# EAGLE design targus-90w-switch-supply-monitor (EAGLE 5.07)
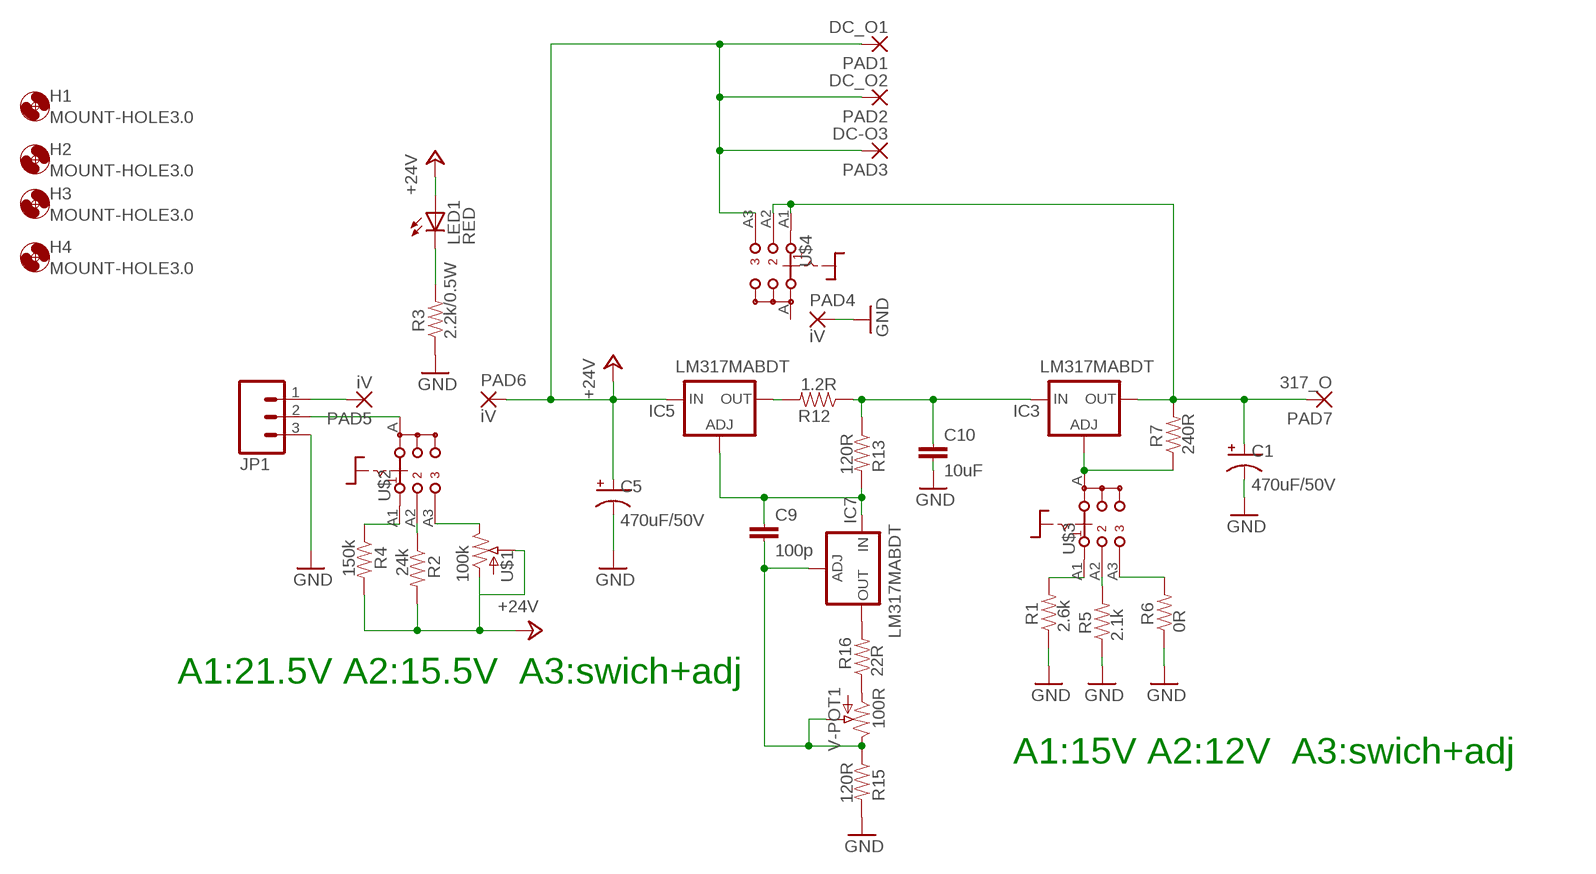
[diagram p0: schematic, sheet 1]

## Parts
C1  470uF/50V  CAP_POL-RF  [CPOL-SMD-10UF-25V]
C5  470uF/50V  CAP_POL-RF  [CPOL-SMD-10UF-25V]
C9  100p  CAP-RF  [CAP-SMD-SMALL]
C10  10uF  CAP-RF  [CAP-SMD-SMALL]
H1  MOUNT-HOLE3.0  [3,0]
H2  MOUNT-HOLE3.0  [3,0]
H3  MOUNT-HOLE3.0  [3,0]
H4  MOUNT-HOLE3.0  [3,0]
IC3  LM317MABDT  [DPACK]
IC5  LM317MABDT  [DPACK]
IC7  LM317MABDT  [DPACK]
JP1  M03VH  [VH-396-3]
LED1  RED  LEDSIDELED  [OSRAM-SIDELED]
PAD1  DC_O1  WIREPADSMD5-2,5  [5-2,5]
PAD2  DC_O2  WIREPADSMD5-2,5  [5-2,5]
PAD3  DC-O3  WIREPADSMD5-2,5  [5-2,5]
PAD4  iV  WIREPADSMD5-2,5  [5-2,5]
PAD5  iV  WIREPADSMD5-2,5  [5-2,5]
PAD6  iV  WIREPADSMD5-2,5  [5-2,5]
PAD7  317_O  WIREPADSMD5-2,5  [5-2,5]
R1  2.6k  RESISTOR1/4W-RF  [AXIAL-0.3-SMD]
R2  24k  RESISTOR1/4W-RF  [AXIAL-0.3-SMD]
R3  2.2k/0.5W  RESISTOR1/4W-RF  [AXIAL-0.3-SMD]
R4  150k  RESISTOR1/4W-RF  [AXIAL-0.3-SMD]
R5  2.1k  RESISTOR1/4W-RF  [AXIAL-0.3-SMD]
R6  0R  RESISTOR1/4W-RF  [AXIAL-0.3-SMD]
R7  240R  RESISTOR1/4W-RF  [AXIAL-0.3-SMD]
R12  1.2R  RESISTOR0617/22(3W)  [0617/22]
R13  120R  RESISTOR1/4W-RF  [AXIAL-0.3-SMD]
R15  120R  RESISTOR1/4W-RF  [AXIAL-0.3-SMD]
R16  22R  RESISTOR1/4W-RF  [AXIAL-0.3-SMD]
U$1  100k  POTPANNEL  [POT-PANNEL]
U$2  ROTATE-SWICH-1X3R  ROTATE-SWICH-1X3P  [ROT-SWITCH-1X3-PANNEL]
U$3  ROTATE-SWICH-1X3R  ROTATE-SWICH-1X3P  [ROT-SWITCH-1X3-PANNEL]
U$4  iV  ROTATE-SWICH-1X3P  [ROT-SWITCH-1X3-PANNEL]
V-POT1  100R  POTPANNEL  [POT-PANNEL]

## Nets
+24V: C5.+ IC5.3(IN) LED1.A PAD1.1(P) PAD2.1(P) PAD3.1(P) PAD6.1(P) R2.P$2 R4.P$2 U$1.A U$1.S U$4.A3
GND: C1.- C5.- C10.P$2 JP1.3 PAD4.1(P) R1.P$1 R3.P$1 R5.P$1 R6.P$1 R15.P$2
N$1: IC3.1(ADJ) R7.P$1 U$3.A
N$2: U$1.E U$2.A3
N$3: R2.P$1 U$2.A2
N$4: R4.P$1 U$2.A1
N$5: JP1.2 U$2.A
N$6: R1.P$2 U$3.A1
N$7: JP1.1 PAD5.1(P)
N$8: LED1.C R3.P$2
N$10: R5.P$2 U$3.A2
N$11: R6.P$2 U$3.A3
N$23: C1.+ IC3.4(OUT) PAD7.1(P) R7.P$2 U$4.A1 U$4.A2
N$24: C10.P$1 IC3.3(IN) R12.1 R13.P$1
N$25: IC5.4(OUT) R12.2
N$26: C9.P$1 IC5.1(ADJ) IC7.3(IN) R13.P$2
N$29: C9.P$2 IC7.1(ADJ) R15.P$1 V-POT1.E V-POT1.S
N$30: IC7.4(OUT) R16.P$2
N$31: R16.P$1 V-POT1.A
Unconnected: U$4.A

## Notes on the sheet
- A1:21.5V A2:15.5V  A3:swich+adj
- A1:15V A2:12V  A3:swich+adj

## Library data of the parts
C1 C5 = digital-toy:CAP_POL: Capacitor Polarized These are standard SMD and PTH capacitors. Normally 10uF, 47uF, and 100uF in electrolytic and tantalum varieties. Always verify the external diameter of the through hole cap, it varies with capacity, voltage, and manufacturer. The EIA devices should be standard. PANASONIC_D size: 6.5mmx6.5mmx5.5mm, 100uf (taobao:6.3mmx5.5mm), same as CVL0605 153cvl0405 size: 4mmx4mmx5.5mm, 10uf (taobao:4mmx5.5mm) ct6032 typical 47uF Tantalum, comment by hyl.
C9 C10 = digital-toy:CAP: Capacitor Standard 0603 ceramic capacitor, and 0.1" leaded capacitor.
H1-H4 = holes:MOUNT-HOLE: MOUNTING HOLE with drill center marker
IC3 IC5 IC7 = v-reg:LM317?*: 500 mA Adjustable Output Positive Voltage Regulator Source: http://www.onsemi.co.jp .. LM317M-D.PDF
JP1 = digital-toy:M03: Header 3 Standard 3-pin 0.1" header. Use with straight break away headers (SKU : PRT-00116), right angle break away headers (PRT-00553), swiss pins (PRT-00743), machine pins (PRT-00117), and female headers (PRT-00115). Molex polarized connector foot print use with SKU : PRT-08232 with associated crimp pins and housings.
LED1 = led:LED: LED OSRAM: - CHIPLED LG R971, LG N971, LY N971, LG Q971, LY Q971, LO R971, LY R971 LH N974, LH R974 LS Q976, LO Q976, LY Q976 LO Q996 - Hyper CHIPLED LW Q18S LB Q993, LB Q99A, LB R99A - SideLED LS A670, LO A670, LY A670, LG A670, LP A670 LB A673, LV A673, LT A673, LW A673 LH A674 LY A675 LS A676, LA A676, LO A676, LY A676, LW A676 LS A679, LY A679, LG A679 - Hyper Micro SIDELED® LS Y876, LA Y876, LO Y876, LY Y876 LT Y87S - SmartLED LW L88C, LW L88S LB L89C, LB L89S, LG L890 LS L89K, LO L89K, LY L89K LS L896, LA L896, LO L896, LY L896 - TOPLED LS T670, LO T670, LY T670, LG T670, LP T670 LSG T670, LSP T670, LSY T670, LOP T670, LYG T670 LG T671, LOG T671, LSG T671 LB T673, LV T673, LT T673, LW T673 LH T674 LS T676, LA T676, LO T676, LY T676, LB T676, LH T676, LSB T676, LW T676 LB T67C, LV T67C, LT T67C, LS T67K, LO T67K, LY T67K, LW E67C LS E67B, LA E67B, LO E67B, LY E67B, LB E67C, LV E67C, LT E67C LW T67C LS T679, LY T679, LG T679 LS T770, LO T770, LY T770, LG T770, LP T770 LB T773, LV T773, LT T773, LW T773 LH T774 LS E675, LA E675, LY E675, LS T675 LS T776, LA T776, LO T776, LY T776, LB T776 LHGB T686 LT T68C, LB T68C - Hyper Mini TOPLED® LB M676 - Mini TOPLED Santana® LG M470 LS M47K, LO M47K, LY M47K Source: http://www.osram.convergy.de LUXEON: - LUMILED® LXK2-PW12-R00, LXK2-PW12-S00, LXK2-PW14-U00, LXK2-PW14-V00 LXK2-PM12-R00, LXK2-PM12-S00, LXK2-PM14-U00 LXK2-PE12-Q00, LXK2-PE12-R00, LXK2-PE12-S00, LXK2-PE14-T00, LXK2-PE14-U00 LXK2-PB12-K00, LXK2-PB12-L00, LXK2-PB12-M00, LXK2-PB14-N00, LXK2-PB14-P00, LXK2-PB14-Q00 LXK2-PR12-L00, LXK2-PR12-M00, LXK2-PR14-Q00, LXK2-PR14-R00 LXK2-PD12-Q00, LXK2-PD12-R00, LXK2-PD12-S00 LXK2-PH12-R00, LXK2-PH12-S00 LXK2-PL12-P00, LXK2-PL12-Q00, LXK2-PL12-R00 Source: www.luxeon.com KINGBRIGHT: KA-3528ASYC Source: www.kingbright.com
PAD1-PAD7 = wirepad:WIREPAD: Wire PAD connect wire on PCB
R1-R7 R12 R13 R15 R16 = digital-toy:RESISTOR: Resistor Basic schematic elements and footprints for 0603, 1206, and PTH 1/10th watt (small) resistors. digital-toy copy vertical mount of axial-0.3 from rcl.lbr : the 0207/xx 3W resistor: 0617/17, 0617/22, 0617V
U$1 V-POT1 = digital-toy:POT: POT digital toy POT, 3296 multi turn, blue-white ... hyl 8/07/2001
U$2-U$4 = digital-toy:ROTATE-SWICH-1X3

## Board
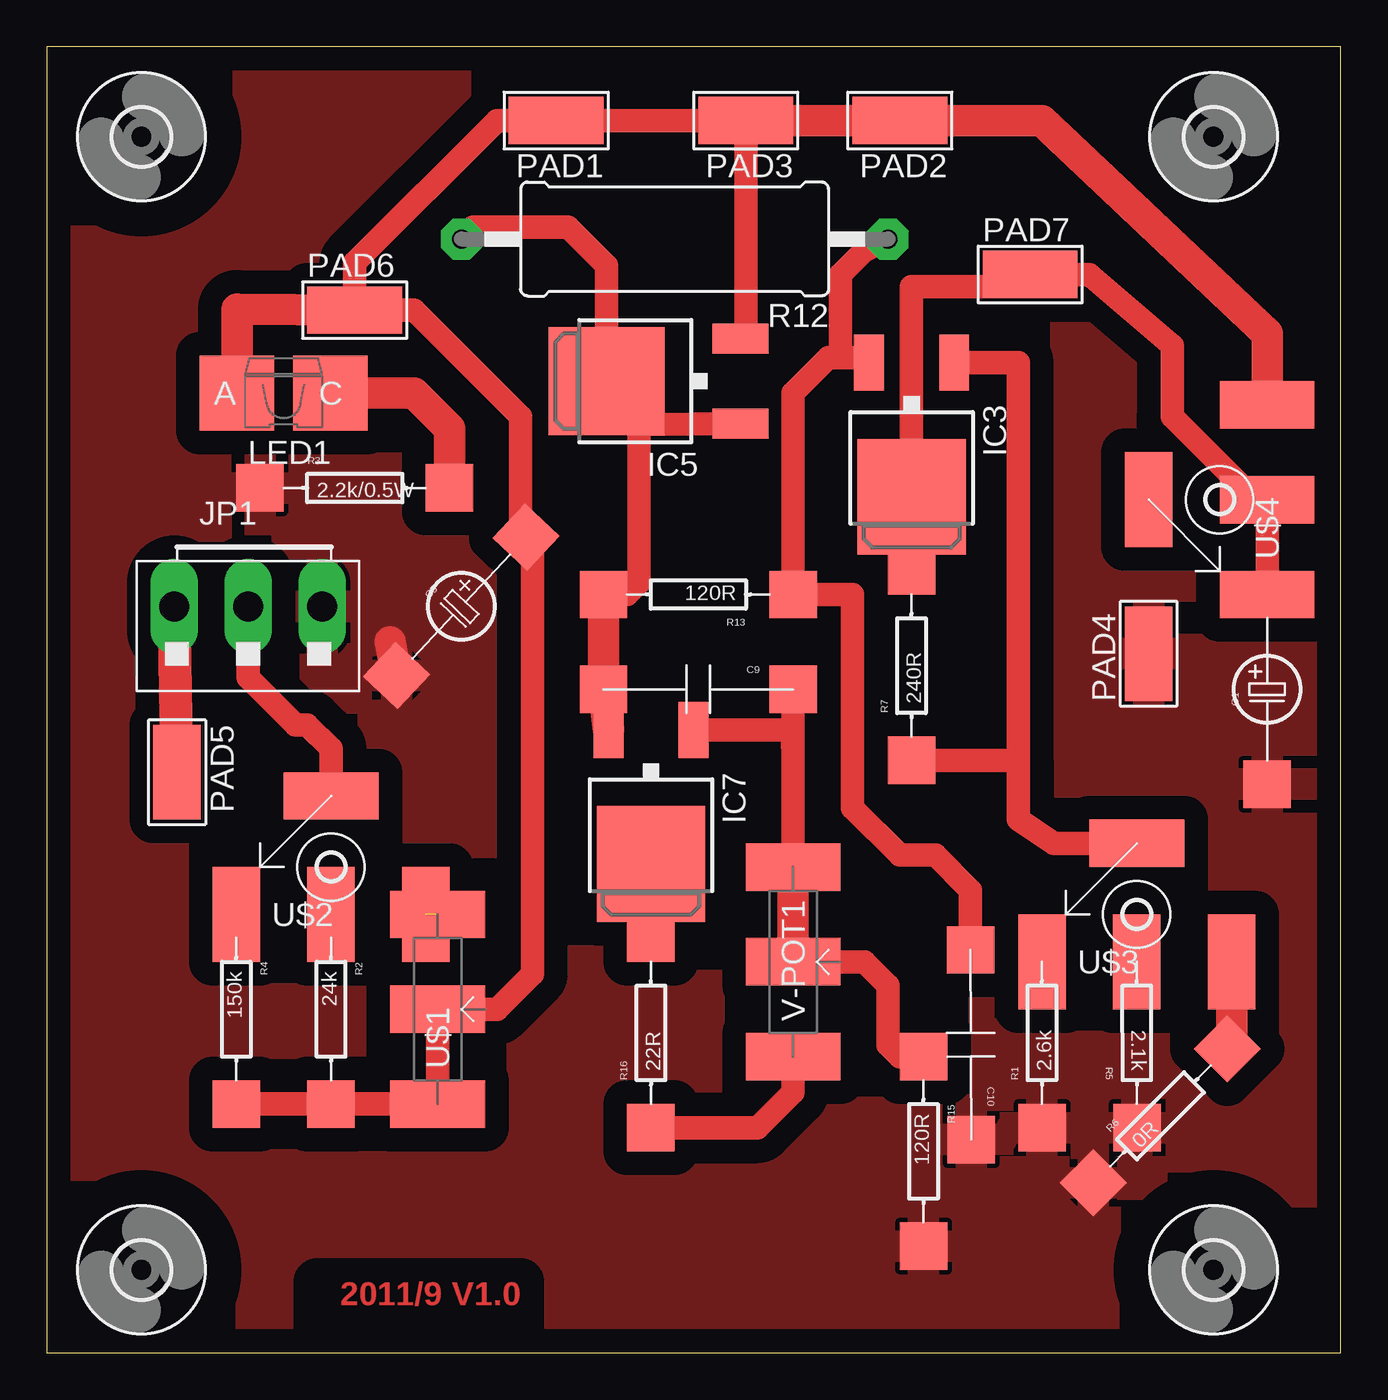
[diagram p1: board, top side]

Size 69.36 x 70 mm. Coordinates in mm from the lower left corner, seen from the top.
Outline: 0,0 69.36,0 69.36,70 0,70 0,0
Copper layers (1*16): Top 0.035mm / dielectric 1.5mm / Bottom 0.035mm
Design rules "SparkFun-RF": minimum track width 8mil, minimum drill 20mil, track to track 8mil, track to pad 8mil, pad to pad 8mil, via to via 8mil, smd to smd 0mil, copper to edge 10mil, drill to drill 8mil, minimum pad ring 12mil, minimum via ring 10mil, stop-mask expansion 4mil, vias tented up to drill 25mil, thermal gap 10mil

### Footprints (pad centres in the part's own frame; a part is rotated, then mirrored left to right if it is on the bottom)
CPOL-SMD-10UF-25V = smd 2.54 x 2.54: + 5.08,0; - -5.08,0
CAP-SMD-SMALL = smd 2.54 x 2.54: P$1 5.08,0; P$2 -5.08,0
3,0 = hole 3: 0,0
DPACK = smd 1.6 x 3: 1 -2.28,-4.8; 3 2.28,-4.8 | smd 5.8 x 6.2: 4 0,2.38
VH-396-3 = drill 1.6 pad 2.54 long: 1 -3.96,0; 2 0,0; 3 3.96,0
OSRAM-SIDELED = smd 4 x 4: A 0,2.5; C 0,-2.5
5-2,5 = smd 2.54 x 5.08: 1 0,0
AXIAL-0.3-SMD = smd 2.54 x 2.54: P$1 -5.08,0; P$2 5.08,0
0617/22 = drill 1.016 pad 2.184 octagon: 1 -11.43,0; 2 11.43,0
POT-PANNEL = smd 2.54 x 5.08: A -6.35,0; E 3.81,0; S -1.27,0
ROT-SWITCH-1X3-PANNEL = smd 5.08 x 2.54: A 0,3.81 | smd 2.54 x 5.08: A1 -5.08,-2.54; A2 0,-2.54; A3 5.08,-2.54

### Placement (x,y rotation side)
C1  65.41,35.56 90 top
C5  22.23,40.01 46.9 top
C9  34.92,35.56 180 top
C10  49.53,16.51 90.2 top
H1  5.08,4.45 0 top
H2  62.53,4.45 0 top
H3  5.08,65.17 0 top
H4  62.53,65.17 0 top
IC3  46.35,48.26 180 top
IC5  32.38,52.07 90 top
IC7  32.38,28.57 180 top
JP1  10.79,40.01 0 top
LED1  12.7,51.44 90 top
PAD1  27.3,66.04 90 top
PAD2  45.72,66.04 90 top
PAD3  37.47,66.04 90 top
PAD4  59.05,37.47 0 top
PAD5  6.99,31.11 180 top
PAD6  16.51,55.88 270 top
PAD7  52.7,57.78 270 top
R1  53.34,17.14 90 top
R2  15.24,18.41 270 top
R3  16.51,46.35 0 top
R4  10.16,18.41 270 top
R5  58.42,17.14 90.1 top
R6  59.69,12.7 45 top
R7  46.35,36.83 90 top
R12  33.66,59.69 180 top
R13  34.92,40.64 180 top
R15  46.99,10.79 270 top
R16  32.38,17.14 90 top
U$1  20.95,19.68 90 top
U$2  15.24,26.04 0 top
U$3  58.42,23.5 0 top
U$4  62.87,45.72 90 top
V-POT1  40.01,22.23 90 top

### Tracks (layer width: path | path; a pad name or v marks a point on that pad's centre or on a via)
+24V
  Top 1.27: U$1.A U$1.S 24.13,18.41 26.04,20.32 26.04,43.42 C5.+ 25.4,43.71 25.4,50.16 19.68,55.88 PAD6.1 16.51,58.42 24.13,66.04 PAD1.1 PAD3.1 37.47,54.63 IC5.3 | R4.P$2 R2.P$2 U$1.A | U$1.A 21.59,13.34 22.23,13.97 21.59,13.97 U$1.A
  Top 1.676: PAD3.1 PAD2.1 53.34,66.04 65.41,54.61 U$4.A3 | LED1.A 10.2,55.92 PAD6.1
GND
  Top 1.676: 14.61,39.37 14.61,40.01 | C5.- 18.41,38.1
  pour Top (isolate 1.27): -10.16,77.47 66.04,77.47 89.53,61.59 89.53,5.71 78.11,-6.99 5.08,-6.99 -13.34,1.91 -13.34,80.64
N$1
  Top 1.27: R7.P$1 52.07,31.75 | U$3.A 53.98,27.3 52.07,28.57 52.07,31.75 | IC3.1 52.07,53.06 52.07,31.75
N$2  (1 unrouted)
N$5
  Top 1.27: JP1.2 10.79,36.2 13.34,33.66 13.97,33.66 15.24,32.38 U$2.A
N$6
  Top 1.27: R1.P$2 53.98,21.59 U$3.A1
N$7
  Top 1.778: PAD5.1 JP1.1
N$8
  Top 1.676: LED1.C 19.68,51.44 21.59,49.53 R3.P$2
N$10
  Top 1.676: U$3.A2 58.42,21.79 R5.P$2
N$11
  Top 1.676: U$3.A3 63.5,17.14 R6.P$2
N$23
  Top 1.27: C1.+ U$4.A2 64.77,45.72 60.33,50.16 60.33,53.98 55.88,57.78 PAD7.1 52.07,57.15 46.35,57.15 IC3.4 R7.P$2
N$24
  Top 1.27: 42.55,53.34 41.91,53.34 40.01,51.44 R13.P$1 43.18,40.64 43.18,29.21 45.72,26.67 47.62,26.67 49.51,24.78 C10.P$1 | 42.55,53.34 44.03,53.34 IC3.3 | R12.1 43.81,59.05 42.55,57.78 42.55,53.34
N$25
  Top 1.27: IC5.4 30,58.26 27.94,60.33 22.86,60.33 R12.2
N$26
  Top 1.27: R13.P$2 31.11,40.64 31.75,41.27 31.75,49.74 IC5.1
  Top 1.676: R13.P$2 C9.P$1 IC7.3
N$29
  Top 1.27: 40.01,25.4 40.01,31.75 | 40.01,31.75 40.01,33.66 | 40.01,33.66 C9.P$2 | 40.01,31.75 39.98,32.99 | V-POT1.S 43.81,20.95 45.09,19.68 45.09,16.51 45.72,15.88 R15.P$1 | IC7.1 39.73,33.38 40.01,33.66
  Top 1.676: V-POT1.S 40.01,25.4 V-POT1.E
N$30
  Top 1.27: R16.P$2 IC7.4
N$31
  Top 1.27: R16.P$1 38.1,12.06 40.01,13.97 V-POT1.A

### Text on the board
Top: 2011/9 V1.0